# EAGLE design Drone (EAGLE 9.6.2)
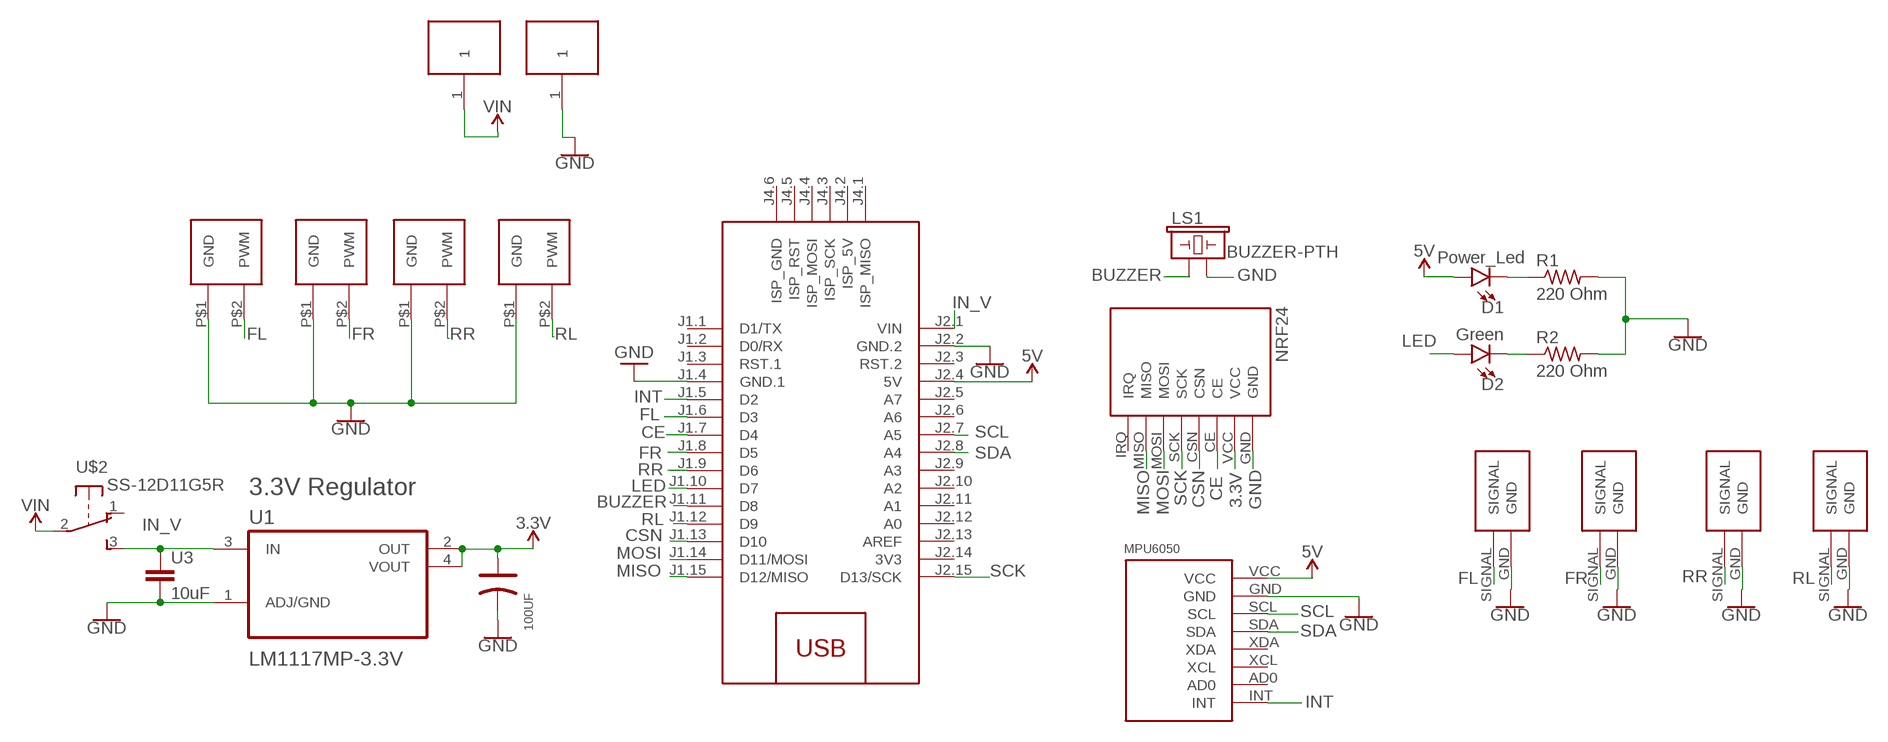
[diagram p0: schematic, sheet 1]

## Parts
D1  Power_Led  LED5MM  [LED_5MM]
D2  Green  LED5MM  [LED_5MM]
LS1  BUZZER-PTH  [BUZZER-12MM]
M1  ARDUINO-NANO-3.0#ISP  [ARDUINO-NANO-3.0#ISP]
R1  220 Ohm  ERJ-8GEY0R00V  [RES_1206]
R2  220 Ohm  ERJ-8GEY0R00V  [RES_1206]
U1  LM1117MP-3.3V  LM1117MP-5.0  [SOT230P700X180-4N]
U2  100UF  [8X10MM]
U3  10uF  10UF-1206-6.3V-20%  [1206]
U$1  MPU6050  [MPU6050]
U$2  SS-12D11G5R  [SWITCH]
U$3  PWM  [PWM]
U$4  PWM  [PWM]
U$5  NRF24  [NRF24]
U$6  PWM  [PWM]
U$7  PWM  [PWM]
U$8  PAD  [PAD]
U$9  PAD  [PAD]
U$10  SIGNAL  [SIGNAL]
U$11  SIGNAL  [SIGNAL]
U$12  SIGNAL  [SIGNAL]
U$13  SIGNAL  [SIGNAL]

## Nets
3.3V: U1.2(OUT) U1.4(VOUT) U2.1(+) U$5.VCC
5V: D1.A M1.J2.4(5V) U$1.VCC
BUZZER: LS1.+ M1.J1.11(D8)
CE: M1.J1.7(D4) U$5.CE
CSN: M1.J1.13(D10) U$5.CSN
FL: M1.J1.6(D3) U$3.P$2(PWM) U$10.SIGNAL
FR: M1.J1.8(D5) U$4.P$2(PWM) U$11.SIGNAL
GND: LS1.- M1.J1.4(GND.1) M1.J2.2(GND.2) R1.2 R2.2 U1.1(ADJ/GND) U2.2(-) U3.2 U$1.GND U$3.P$1(GND) U$4.P$1(GND) U$5.GND U$6.P$1(GND) U$7.P$1(GND) U$9.1 U$10.GND U$11.GND U$12.GND U$13.GND
IN_V: M1.J2.1(VIN) U1.3(IN) U3.1 U$2.3(S)
INT: M1.J1.5(D2) U$1.INT
LED: D2.A M1.J1.10(D7)
MISO: M1.J1.15(D12/MISO) U$5.MISO
MOSI: M1.J1.14(D11/MOSI) U$5.MOSI
N$2: D1.K(C) R1.1
N$3: D2.K(C) R2.1
RL: M1.J1.12(D9) U$7.P$2(PWM) U$13.SIGNAL
RR: M1.J1.9(D6) U$6.P$2(PWM) U$12.SIGNAL
SCK: M1.J2.15(D13/SCK) U$5.SCK
SCL: M1.J2.7(A5) U$1.SCL
SDA: M1.J2.8(A4) U$1.SDA
VIN: U$2.2(P) U$8.1
Unconnected: M1.J1.1(D1/TX) M1.J1.2(D0/RX) M1.J1.3(RST.1) M1.J2.3(RST.2) M1.J2.5(A7) M1.J2.6(A6) M1.J2.9(A3) M1.J2.10(A2) M1.J2.11(A1) M1.J2.12(A0) M1.J2.13(AREF) M1.J4.1(ISP_MISO) M1.J4.2(ISP_5V) M1.J4.3(ISP_SCK) M1.J4.4(ISP_MOSI) M1.J4.5(ISP_RST) M1.J4.6(ISP_GND) U$1.AD0 U$1.XCL U$1.XDA U$2.1(O) U$5.IRQ

## Notes on the sheet
- 3.3V Regulator

## Power pins joined to a net without a drawn wire
3V3: M1.J2.14(3V3)

## Library data of the parts
D1 D2 = SparkFun-LED:LED: LED (Generic) Standard schematic elements and footprints for 5mm, 3mm, 1206, and 0603 sized LEDs. Generic LEDs with no color specified.
LS1 = SparkFun-Electromechanical:BUZZER: Buzzer Small round buzzers that operate around the audible 2kHz range. You can use these as speakers to create simple music or user interfaces. Variant Overview: PTH - Mini Speaker - PC Mount 12mm 2.048kHz <https://www.sparkfun.com/products/7950> PTH_KIT - Mini Speaker - PC Mount 12mm 2.048kHz <https://www.sparkfun.com/products/7950> KIT simplifies soldering by adding stop mask to one side of the pads. PTH_NO_SILK - Mini Speaker - PC Mount 12mm 2.048kHz <https://www.sparkfun.com/products/7950> No silkscreen indicator of buzzer outline. PTH_KIT_NO_SILK - Mini Speaker - PC Mount 12mm 2.048kHz <https://www.sparkfun.com/products/7950> KIT package w/o silkscreen SMD - Buzzer Audio Magnetic (CCV-084B16) SMD buzzer used on, e.g. the LilyPad Buzzer <https://www.sparkfun.com/products/8463> and RFID USB Reader <https://www.sparkfun.com/products/9963>. SMD_KIT - Buzzer Audio Magnetic (CCV-084B16) SMD Buzzer with elongated pins to make soldering easier. Used on the SparkFun Simon Says - Surface Mount Soldering Kit <https://www.sparkfun.com/products/10935>.; PROD_ID: COMP-08253; SF_SKU: COM-07950
M1 = diy-modules:ARDUINO-NANO-3.0#ISP: Arduino Nano 3.0 with ISP pads
R1 R2 = Resistor_Capacitor:ERJ-8GEY0R00V: RES SMD 0 OHM JUMPER 1/4W 1206 Manufacturer's datasheet <https://industrial.panasonic.com/ww/products/resistors/chip-resistors/general-purpose-chip-resistors/thick-film-chip-resistors/ERJ8GEY0R00V>; CREATED_BY: PCBLayout.com; DIGIKEY_PART_NUMBER: P0.0ETR-ND; MANUFACTURER: Panasonic Electronic Components; MPN: ERJ-8GEY0R00V; PACKAGE: SMD 1206
U1 = SnapEDA Library:LM1117MP-5.0
U2 = nrf24:100UF
U3 = SparkFun-Capacitors:10UF: 10.0µF ceramic capacitors A capacitor is a passive two-terminal electrical component used to store electrical energy temporarily in an electric field.; PROD_ID: CAP-10057
U$1 = nrf24:MPU6050
U$2 = nrf24:SS-12D11G5R
U$3 U$4 U$6 U$7 = nrf24:PWM
U$5 = nrf24:NRF24
U$8 U$9 = Akim:PAD
U$10-U$13 = nrf24:SIGNAL

## Net classes
0 default: width 0.61 mm

## Board
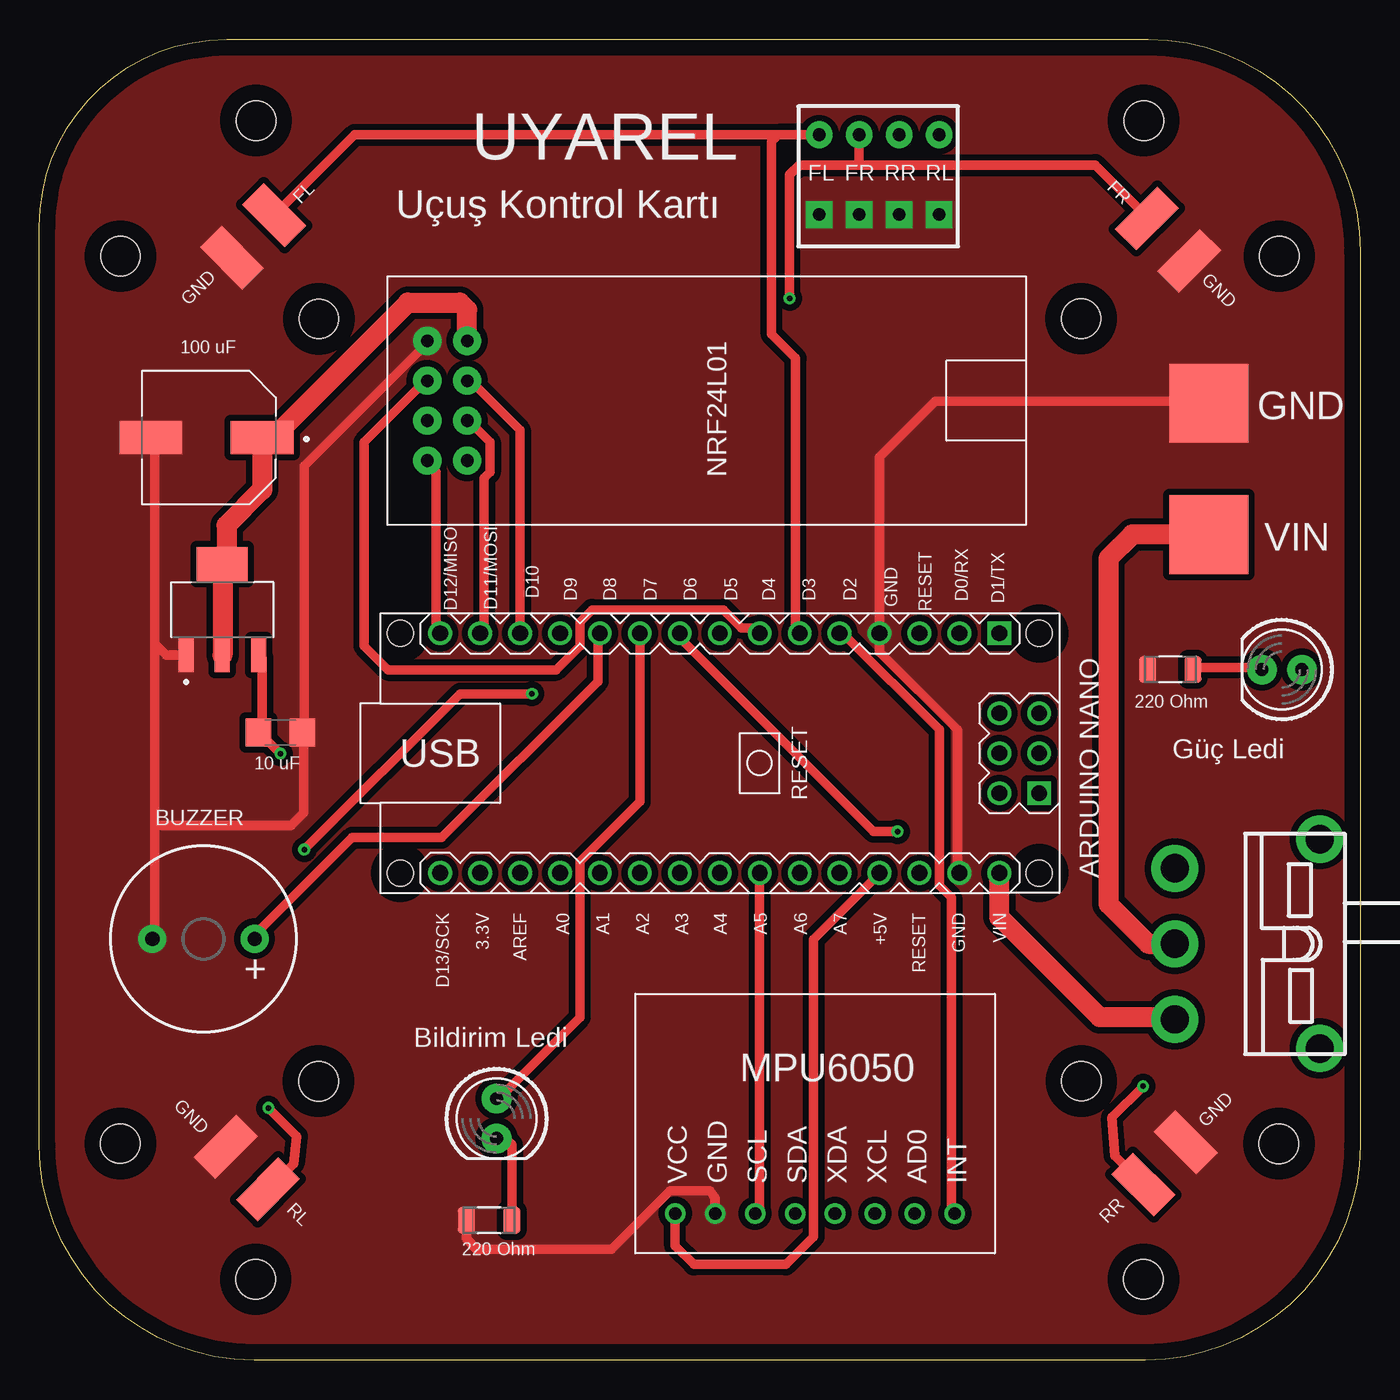
[diagram p1: board, top side]
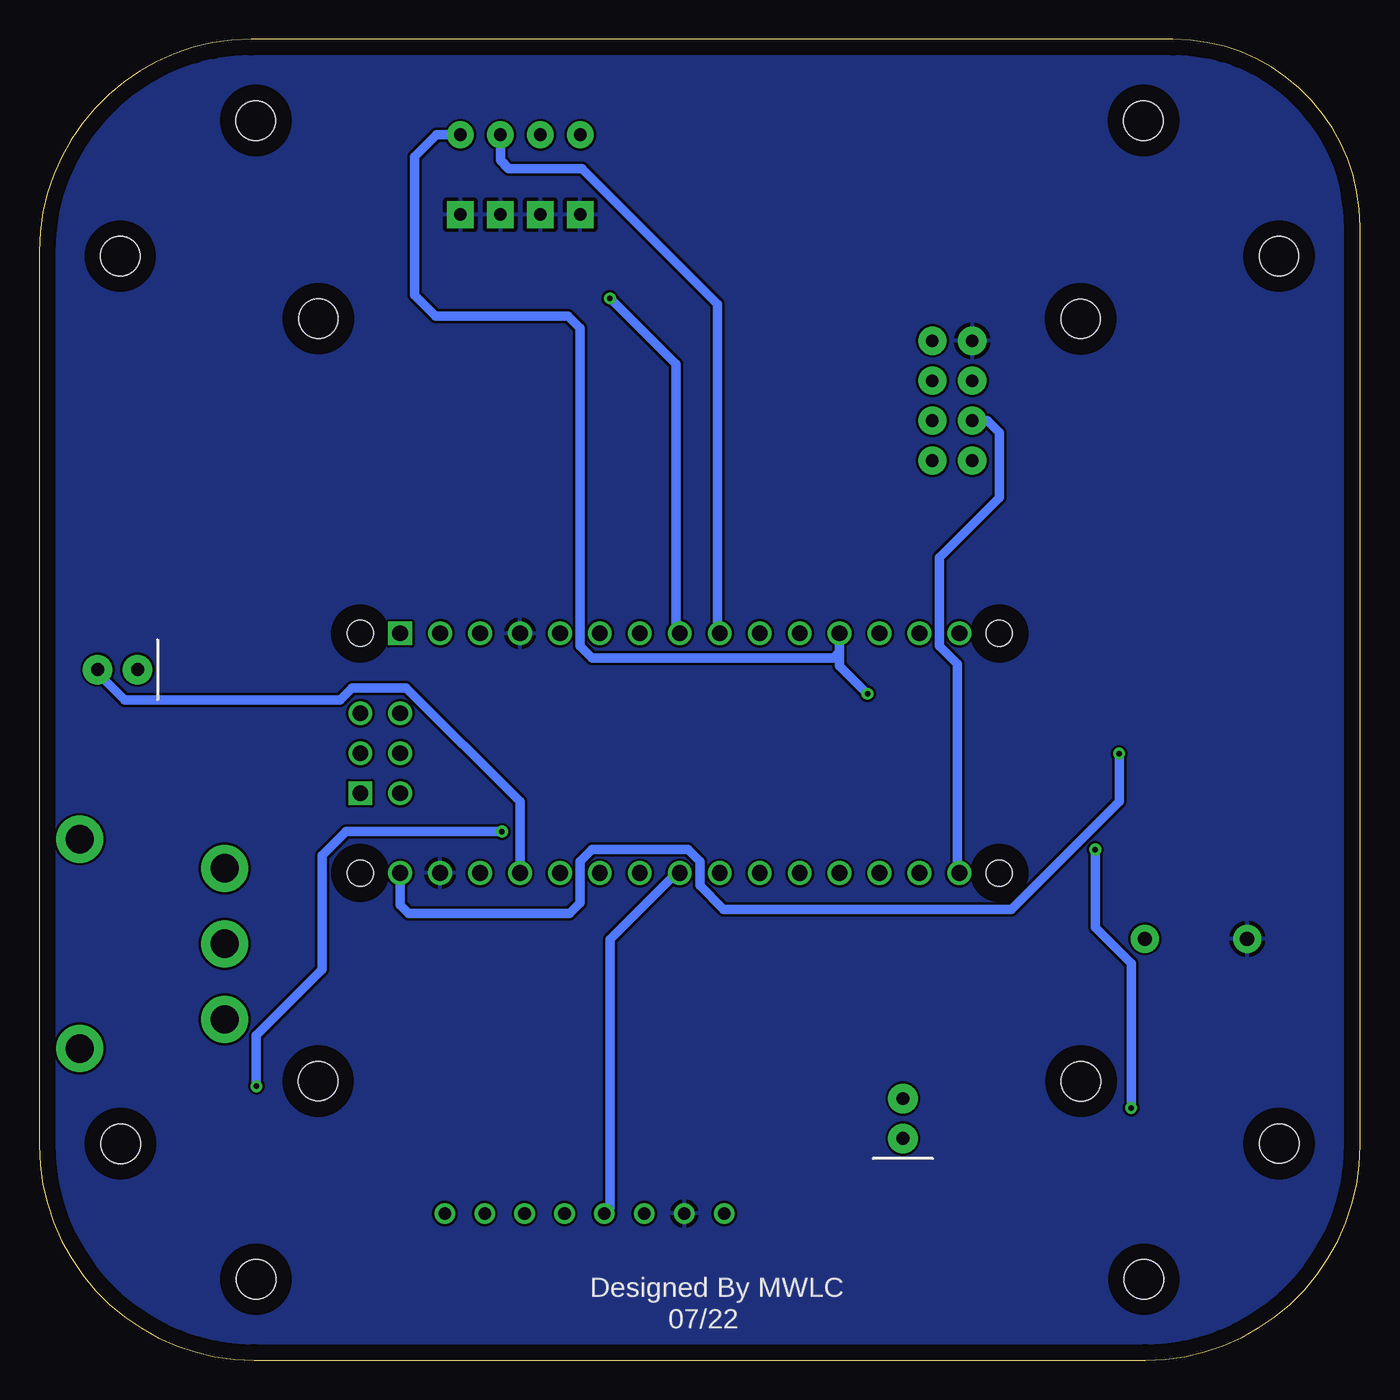
[diagram p2: board, bottom side, seen from below]

Size 84 x 84 mm. Coordinates in mm from the lower left corner, seen from the top.
Outline: 70.34,0 13.66,0 arc-90 0,13.66 0,72.1 arc-90 11.9,84 70.52,84 arc-90 84,70.52 84,13.66 arc-90 70.34,0
Copper layers (1*16): Top 0.035mm / dielectric 1.5mm / Bottom 0.035mm
Design rules "default": minimum track width 6mil, minimum drill 0.35mm, track to track 6mil, track to pad 6mil, pad to pad 6mil, via to via 6mil, smd to smd 6mil, copper to edge 40mil, drill to drill 6mil, minimum pad ring 10mil, minimum via ring 8mil, stop-mask expansion 4mil, vias tented up to drill 0mil, thermal gap 10mil
Holes 2.5 mm at 17.75,17.74 13.76,5.15 5.15,13.77 66.27,17.75 78.84,13.77 70.22,5.14 66.25,66.24 78.86,70.21 70.23,78.83 17.78,66.22 5.16,70.2 13.78,78.84

### Footprints (pad centres in the part's own frame; a part is rotated, then mirrored left to right if it is on the bottom)
LED_5MM = drill 0.813 pad 1.88: A -1.27,0; K 1.27,0
BUZZER-12MM = drill 0.9 pad 1.778: + 3.25,0; - -3.25,0
ARDUINO-NANO-3.0#ISP = drill 1 square: J1.1 17.78,7.62; J4.1 20.32,-2.54 | drill 1: J1.2 15.24,7.62; J1.3 12.7,7.62; J1.4 10.16,7.62; J1.5 7.62,7.62; J1.6 5.08,7.62; J1.7 2.54,7.62; J1.8 0,7.62; J1.9 -2.54,7.62; J1.10 -5.08,7.62; J1.11 -7.62,7.62; J1.12 -10.16,7.62; J1.13 -12.7,7.62; J1.14 -15.24,7.62; J1.15 -17.78,7.62; J2.1 17.78,-7.62; J2.2 15.24,-7.62; J2.3 12.7,-7.62; J2.4 10.16,-7.62; J2.5 7.62,-7.62; J2.6 5.08,-7.62; J2.7 2.54,-7.62; J2.8 0,-7.62; J2.9 -2.54,-7.62; J2.10 -5.08,-7.62; J2.11 -7.62,-7.62; J2.12 -10.16,-7.62; J2.13 -12.7,-7.62; J2.14 -15.24,-7.62; J2.15 -17.78,-7.62; J4.2 17.78,-2.54; J4.3 20.32,0; J4.4 17.78,0; J4.5 20.32,2.54; J4.6 17.78,2.54 | hole 1.651: -20.32,7.62; -20.32,-7.62; 20.32,-7.62; 20.32,7.62
RES_1206 = smd 1.08 x 1.68: 1 -1.445,0; 2 1.445,0
SOT230P700X180-4N = smd 2.15 x 0.95: 1 -2.9,2.3; 2 -2.9,0; 3 -2.9,-2.3 | smd 2.15 x 3.25: 4 2.9,0
8X10MM = smd 4 x 2.1: 1 0.01,0; 2 7.09,0
1206 = smd 1.6 x 1.8: 1 -1.4,0; 2 1.4,0
MPU6050 = drill 0.8 pad 1.27: AD0 0,-7.62; GND 0,5.08; INT 0,-10.16; SCL 0,2.54; SDA 0,0; VCC 0,7.62; XCL 0,-5.08; XDA 0,-2.54
SWITCH = drill 1.803 pad 2.997: 1 0.025,-0.025; 2 4.826,-0.025; 3 9.627,-0.025; 4 11.481,9.195; 5 -1.829,9.195
PWM = drill 0.8 pad 1.7 square: P$1 0,0 | drill 0.8 pad 1.7: P$2 5.08,0
NRF24 = drill 0.8 pad 1.8: CE 2.54,-2.54; CSN 2.54,0; GND 0,-2.54; IRQ 7.62,0; MISO 7.62,-2.54; MOSI 5.08,0; SCK 5.08,-2.54; VCC 0,0
PAD = smd 5 x 5: 1 0,0
SIGNAL = smd 1.93 x 3.81: GND 3.81,0; SIGNAL 0,0

### Placement (x,y rotation side)
D1  79.02,43.92 180 top
D2  29.08,15.37 270 top
LS1  10.44,26.8 0 top
M1  43.27,38.6 0 top
R1  71.92,43.93 180 top
R2  28.61,8.89 180 top
U1  11.64,47.73 90 top
U2  14.19,58.67 180 top
U3  15.34,39.92 0 top
U$1  48.06,9.33 90 top
U$2  72.24,31.3 270 top
U$3  49.6,72.85 90 top
U$4  52.14,72.85 90 top
U$5  27.21,64.83 270 top
U$6  54.68,72.85 90 top
U$7  57.22,72.85 90 top
U$8  74.37,52.51 180 top
U$9  74.37,60.86 180 top
U$10  14.94,72.81 225 top
U$11  70.44,72.61 315 top
U$12  70.22,11.17 45 top
U$13  14.54,10.87 135 top

### Tracks (layer width: path | path; a pad name or v marks a point on that pad's centre or on a via)
3.3V
  Top 0.61: U1.2 | U1.4 11.9,50.76
  Top 1.27: U1.4 U1.2 | U$5.VCC 27.21,66.79 26.74,67.26 23.45,67.26 14.86,58.67 U2.1 14.18,55.36 11.9,53.08 11.9,50.76
5V
  Top 0.61: M1.J2.4 53.43,30.95 49.24,26.76 49.24,7.85 47.48,6.09 41.62,6.09 40.44,7.27 U$1.VCC
  Bottom 0.61: M1.J2.4 53.43,35.52 60.67,42.76 64.1,42.76 64.86,42 78.58,42 80.1,43.52 80.1,43.91 D1.A
BUZZER
  Top 0.61: M1.J1.11 35.52,46.19 35.52,43.18 25.58,33.24 19.9,33.24 13.81,27.14 LS1.+
CE
  Top 0.61: M1.J1.7 45.81,46.57 44.67,46.57 43.52,47.72 35.14,47.72 34.38,46.95 34.38,45.43 32.86,43.91 22.19,43.91 20.66,45.43 20.66,58.38 24.47,62.19 U$5.CE
CSN
  Top 0.61: M1.J1.13 30.57,59.14 27.52,62.19 U$5.CSN
FL
  Top 0.61: U$3.P$2 47,77.93 | U$10.SIGNAL 20.06,77.93 47,77.93 | 47,77.93 46.57,77.5 46.57,65.24 48.1,63.72 48.1,46.47 M1.J1.6
FR  (via drill 0.35)
  Top 0.61: U$11.SIGNAL 70.44,72.71 67.15,76 52,76 | v47.72,67.53 47.72,75.38 48.33,76 52,76 | 52,76 52.14,76.14 U$4.P$2
  Bottom 0.61: M1.J1.8 43.52,46.57 43.52,63.34 v47.72,67.53
GND
  Top 0.61: R2.2 27.16,7.71 27.81,7.06 36.4,7.06 40.09,10.76 42.65,10.76 42.98,10.33 U$1.GND | LS1.- 7.33,27.14 7.33,34 | 7.33,45.58 7.33,58.38 U2.2 | U1.1 8.08,44.84 7.33,45.58 | M1.J2.2 58.38,31.33 58.38,40.09 53.43,45.05 M1.J1.4 53.43,57.43 57,61 74.23,61 U$9.1 | U$5.GND 24.47,64.48 16.85,56.86 16.85,40.09 U3.2 16.82,39.84 16.82,34.81 16,34 7.33,34 | 7.33,34 7.33,45.58
  pour Top (isolate 0.4, no thermals): 84,70.52 84,13.48 arc-90 70.52,0 13.48,0 arc-90 0,13.48 0,72.1 arc-90 11.9,84 70.52,84 arc-90
  pour Bottom: 0,72.1 0,13.48 arc90 13.48,0 70.52,0 arc90 84,13.48 84,70.34 arc90 70.34,84 11.9,84 arc90
IN_V  (via drill 0.35)
  Top 0.61: U1.3 14.19,44.67 14.19,40.09 U3.1 14.19,39.71 v15.33,38.57 | 72.1,21.81 U$2.3
  Top 1.27: M1.J2.1 61.05,28.19 67.43,21.81 72.1,21.81
  Bottom 0.61: v15.33,38.57 15.33,35.52 22.19,28.66 40.48,28.66 42,30.19 42,31.71 42.76,32.48 48.86,32.48 49.62,31.71 49.62,29.09 50.28,28.43 60.53,28.43 61.05,28.95 M1.J2.1
INT
  Top 0.61: U$1.INT 58,9.62 58,29.43 57.24,30.19 57.24,40.09 51.14,46.19 M1.J1.5
LED
  Top 0.61: M1.J1.10 38.19,35.52 34.38,31.71 34.38,21.81 29.43,16.85 D2.A
MISO
  Top 0.61: M1.J1.15 25.24,46.57 25.24,56.48 24.86,56.86 U$5.MISO
MOSI
  Top 0.61: M1.J1.14 28.28,46.57 28.28,56.1 28.66,56.48 28.66,58.38 27.52,59.53 U$5.MOSI
N$2
  Top 0.61: R1.1 73.72,44.05 77.53,44.05 D1.K
N$3
  Top 0.61: R2.1 30.06,8.91 30.06,13.71 29.6,14.1 D2.K
RL  (via drill 0.35)
  Top 0.61: v14.57,16.04 16.37,14.24 16.17,12.5 U$13.SIGNAL | v16.85,32.48 26.76,42.38 v31.33,42.38
  Bottom 0.61: v14.57,16.04 14.57,25.24 16.85,27.52 v16.85,32.48 | U$7.P$2 58.74,77.93 60.14,76.53 60.14,67.72 58.81,66.38 50.38,66.38 49.62,65.62 49.62,45.43 48.86,44.67 33.48,44.67 33.11,45.03 | M1.J1.12 33.11,45.03 | v31.33,42.38 33.11,44.16 33.11,45.03
RR  (via drill 0.35)
  Top 0.61: v70.19,17.43 68.22,15.45 68.39,13 U$12.SIGNAL | v54.57,33.62 53.05,33.62 40.48,46.19 M1.J1.9
  Bottom 0.61: M1.J1.9 40.86,46.57 40.86,67.15 49.48,75.77 54.14,75.77 54.68,76.3 U$6.P$2 | v70.19,17.43 70.19,20.66 66,24.86 66,32.09 64.48,33.62 v54.57,33.62
SCK
  Bottom 0.61: U$5.SCK 23.7,59.75 22.95,59 22.95,54.86 26.76,51.05 26.76,45.43 25.62,44.29 25.62,31.33 M1.J2.15
SCL
  Top 0.61: M1.J2.7 45.81,9.62 U$1.SCL
SDA
  Bottom 0.61: U$1.SDA 47.72,9.62 47.72,26.76 43.52,30.95 M1.J2.8
VIN
  Top 1.27: U$8.1 69.51,52.51 68,51 68,29 70.52,26.48 U$2.2

### Text on the board
tNames: UYAREL | FL | FL | FR | RR | RL | FR | Uçuş Kontrol Kartı | GND | GND | 100 uF | GND | D12/MISO | D11/MOSI | VIN | D0/RX | D10 | RESET | D1/TX | D9 | D8 | D7 | D6 | D5 | D4 | D3 | D2 | GND | ARDUINO NANO | 220 Ohm | Güç Ledi | 10 uF | BUZZER | D13/SCK | 3.3V | AREF | A0 | A1 | A2 | A3 | A4 | A5 | A6 | A7 | +5V | RESET | GND | VIN | + | Bildirim Ledi | GND | GND | RL | RR | 220 Ohm
bNames: Designed By MWLC | 07/22